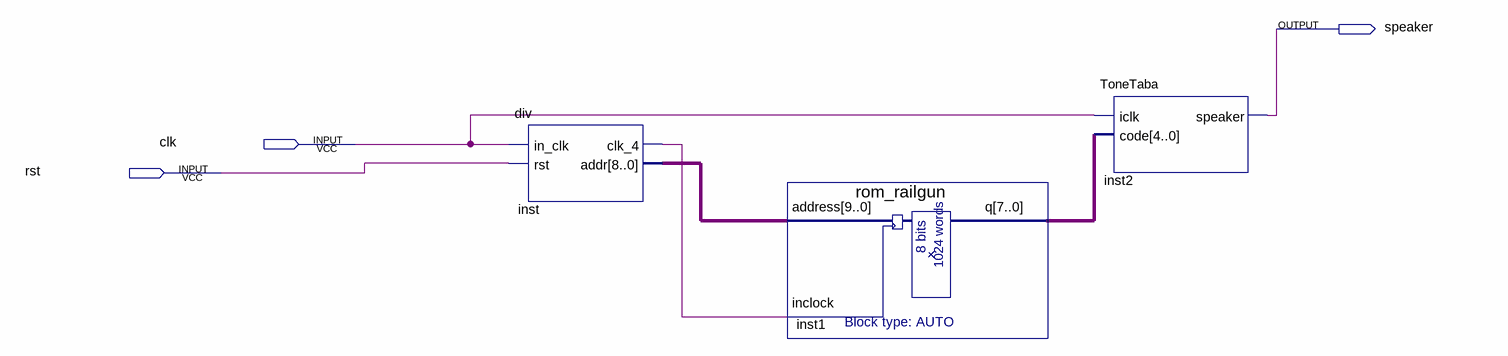
[diagram p0: schematic sheet]
// Quartus schematic music.bdf as structural Verilog: 3 symbols, 3 pins
module music (
  input  clk,
  input  rst,
  output speaker
);

  wire inst_clk_4;
  wire [7:0] inst1_q;
  wire [9:0] inst_addr;

  div inst (.in_clk(clk), .rst(rst), .clk_4(inst_clk_4), .addr(inst_addr));
  rom_railgun inst1 (.address(inst_addr), .inclock(inst_clk_4), .q(inst1_q));
  ToneTaba inst2 (.iclk(clk), .code(inst1_q), .speaker(speaker));
endmodule
